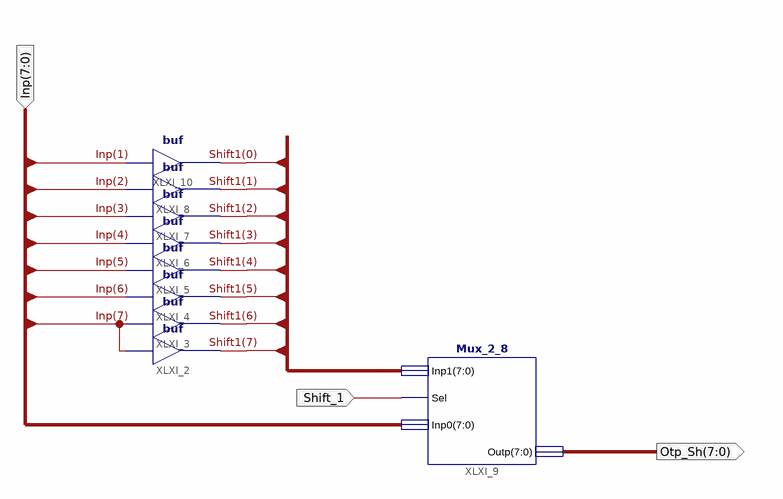
[diagram p0: schematic sheet 1]
// Xilinx ISE schematic One_Bit_shifter_8.sch (spartan3e) as structural Verilog: 9 symbols, 3 ports
module One_Bit_shifter_8 (
  input  [7:0] Inp,
  input  Shift_1,
  output [7:0] Otp_Sh
);

  wire [7:0] Shift1;

  buf XLXI_2 (Shift1[7], Inp[7]);
  buf XLXI_3 (Shift1[6], Inp[7]);
  buf XLXI_4 (Shift1[5], Inp[6]);
  buf XLXI_5 (Shift1[4], Inp[5]);
  buf XLXI_6 (Shift1[3], Inp[4]);
  buf XLXI_7 (Shift1[2], Inp[3]);
  buf XLXI_8 (Shift1[1], Inp[2]);
  Mux_2_8 XLXI_9 (.Inp1(Shift1), .Sel(Shift_1), .Inp0(Inp), .Outp(Otp_Sh));
  buf XLXI_10 (Shift1[0], Inp[1]);
endmodule
